# Altium schematic sheet Tray2_Power.SchDoc
size A3
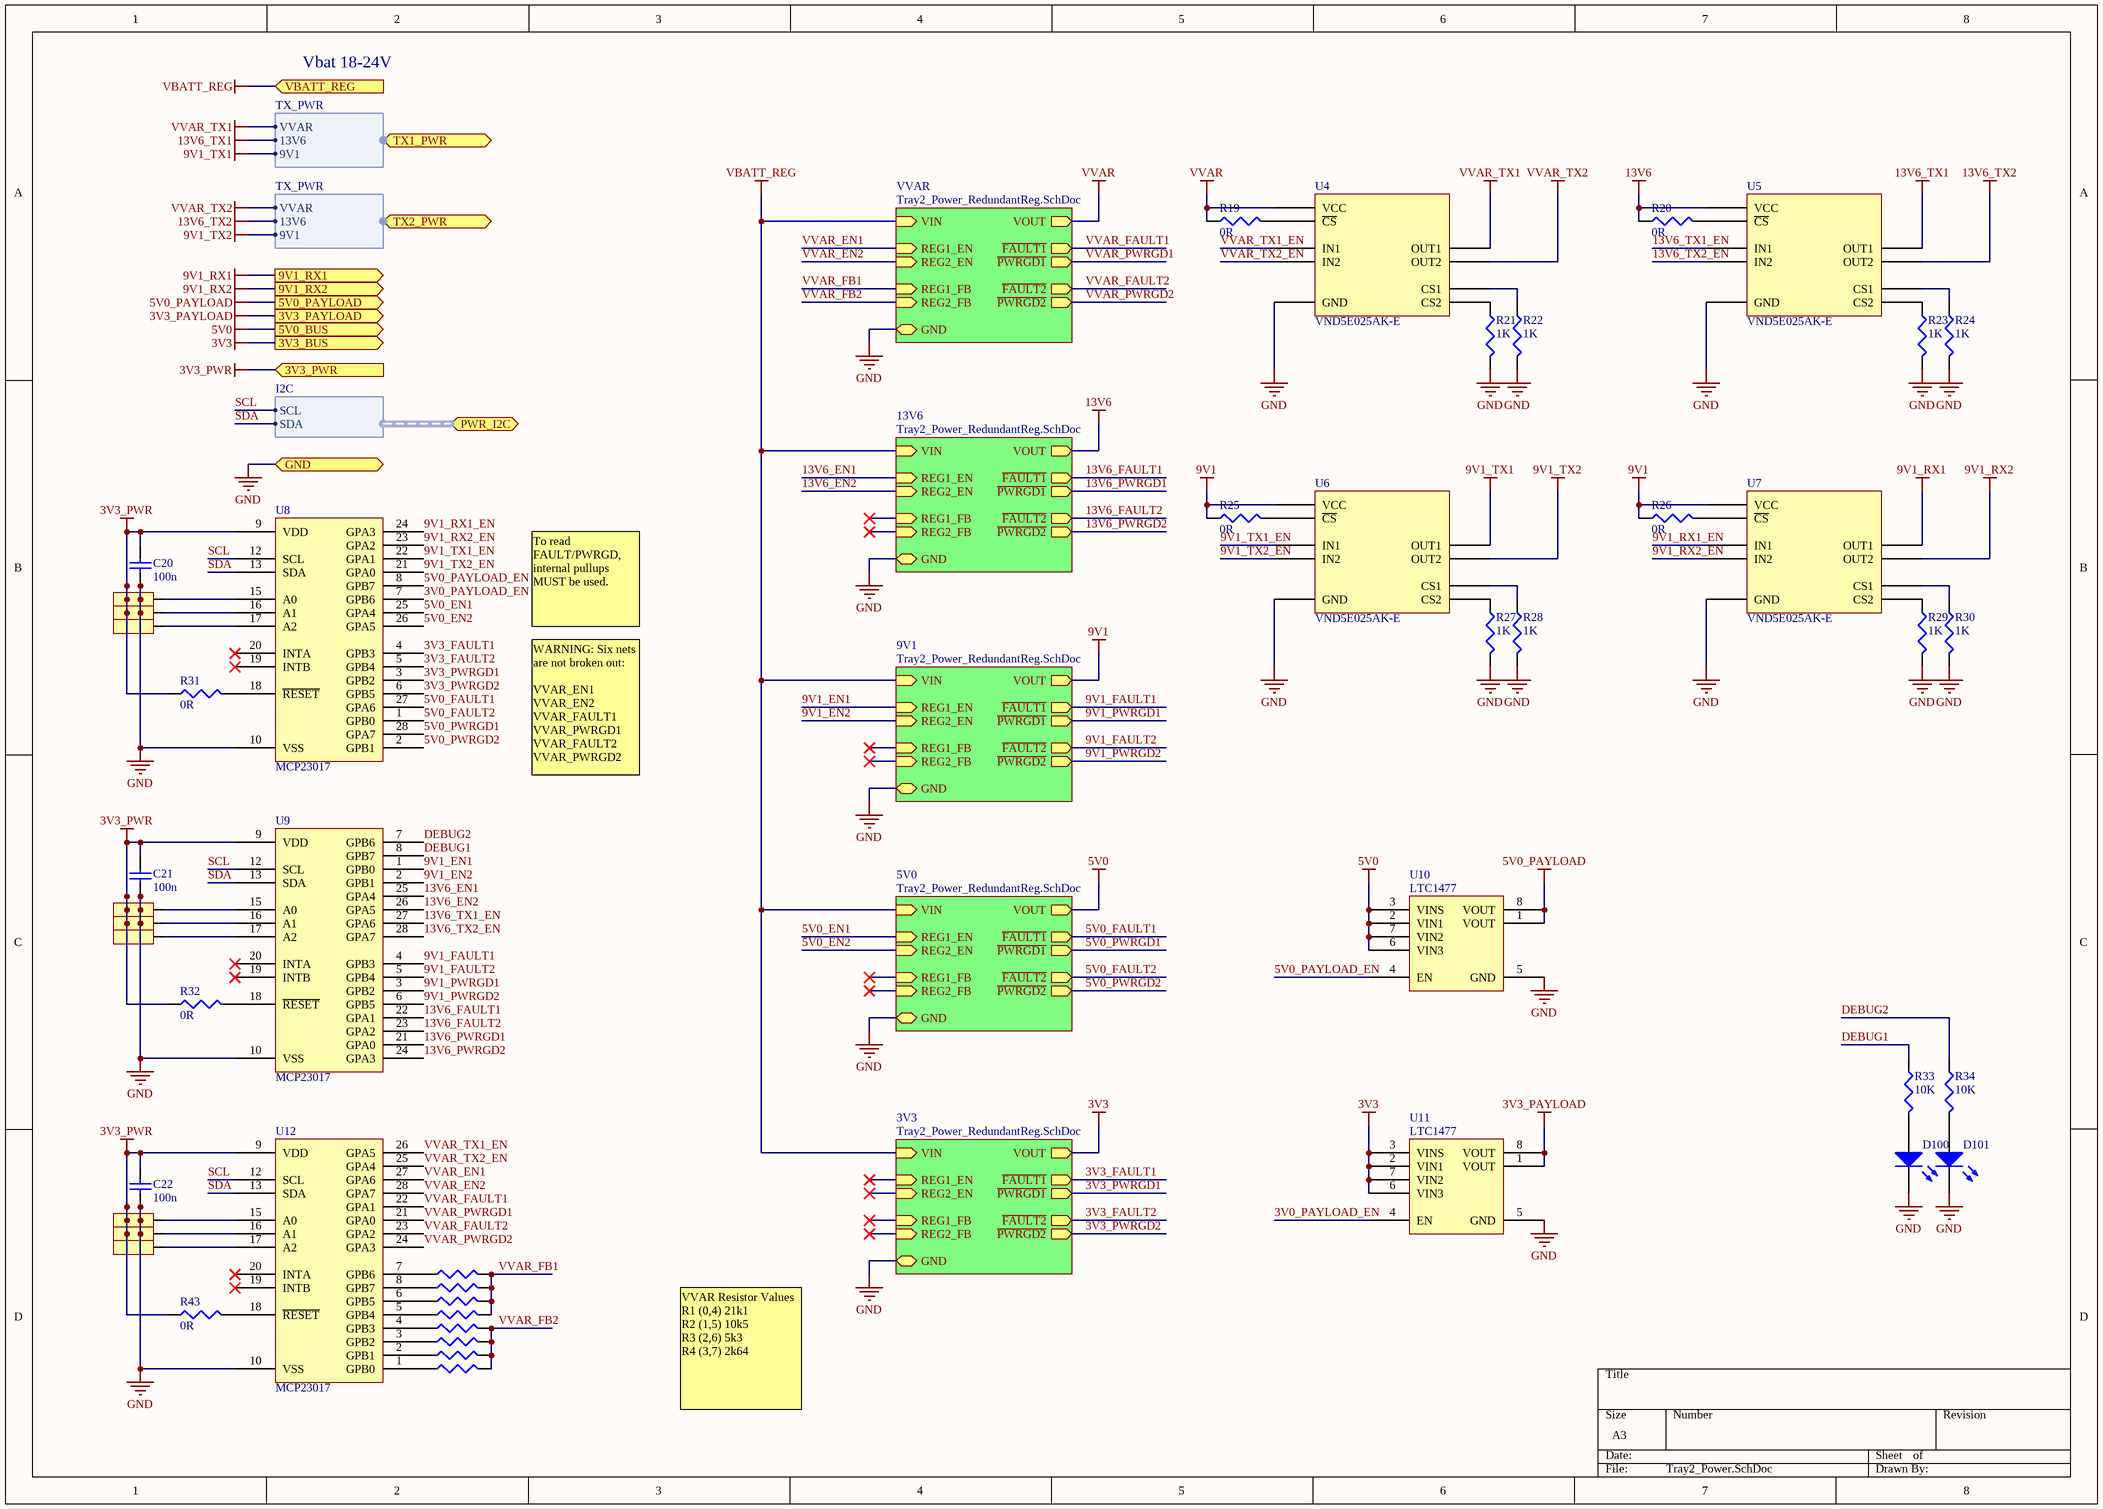
[diagram p0: Tray2_Power.SchDoc]

## Parts
C20  value 100n  [R0805M]
C21  value 100n  [R0805M]
C22  value 100n  [R0805M]
D100  LED0  [R0805M]  (value not drawn)
D101  LED0  [R0805M]  (value not drawn)
J1  3-WAY JUMPER  [J1205M]  (value not drawn)
J2  3-WAY JUMPER  [J1205M]  (value not drawn)
J3  3-WAY JUMPER  [J1205M]  (value not drawn)
J4  3-WAY JUMPER  [J1205M]  (value not drawn)
J5  3-WAY JUMPER  [J1205M]  (value not drawn)
J6  3-WAY JUMPER  [J1205M]  (value not drawn)
J7  3-WAY JUMPER  [J1205M]  (value not drawn)
J8  3-WAY JUMPER  [J1205M]  (value not drawn)
J9  3-WAY JUMPER  [J1205M]  (value not drawn)
R19  value 0R  [R0402M]
R20  value 0R  [R0402M]
R21  value 1K  [R0402M]
R22  value 1K  [R0402M]
R23  value 1K  [R0402M]
R24  value 1K  [R0402M]
R25  value 0R  [R0402M]
R26  value 0R  [R0402M]
R27  value 1K  [R0402M]
R28  value 1K  [R0402M]
R29  value 1K  [R0402M]
R30  value 1K  [R0402M]
R31  value 0R  [R0402M]
R32  value 0R  [R0402M]
R33  value 10K  [R0402M]
R34  value 10K  [R0402M]
R35  VSET_1  [R0805M]  (value not drawn)
R36  VSET_1  [R0805M]  (value not drawn)
R37  VSET_1  [R0805M]  (value not drawn)
R38  VSET_1  [R0805M]  (value not drawn)
R39  VSET_1  [R0805M]  (value not drawn)
R40  VSET_1  [R0805M]  (value not drawn)
R41  VSET_1  [R0805M]  (value not drawn)
R42  VSET_1  [R0805M]  (value not drawn)
R43  value 0R  [R0402M]
U4  VND5E025AK-E  [SSO24]
U5  VND5E025AK-E  [SSO24]
U6  VND5E025AK-E  [SSO24]
U7  VND5E025AK-E  [SSO24]
U8  MCP23017  [SSOP28]
U9  MCP23017  [SSOP28]
U10  LTC1477  [SO8]
U11  LTC1477  [SO8]
U12  MCP23017  [SSOP28]

## Sub-sheets
3V3 = Tray2_Power_RedundantReg.SchDoc: REG1_EN (in), REG2_EN (in), VIN (in), VOUT (out), REG1_FB (in), REG2_FB (in), GND, ~{FAULT1} (out), ~{FAULT2} (out), ~{PWRGD1} (out), ~{PWRGD2} (out)
5V0 = Tray2_Power_RedundantReg.SchDoc: REG1_EN (in), REG2_EN (in), VIN (in), VOUT (out), REG1_FB (in), REG2_FB (in), GND, ~{FAULT1} (out), ~{FAULT2} (out), ~{PWRGD1} (out), ~{PWRGD2} (out)
9V1 = Tray2_Power_RedundantReg.SchDoc: REG1_EN (in), REG2_EN (in), VIN (in), VOUT (out), REG1_FB (in), REG2_FB (in), GND, ~{FAULT1} (out), ~{FAULT2} (out), ~{PWRGD1} (out), ~{PWRGD2} (out)
13V6 = Tray2_Power_RedundantReg.SchDoc: REG1_EN (in), REG2_EN (in), VIN (in), VOUT (out), REG1_FB (in), REG2_FB (in), GND, ~{FAULT1} (out), ~{FAULT2} (out), ~{PWRGD1} (out), ~{PWRGD2} (out)
VVAR = Tray2_Power_RedundantReg.SchDoc: REG1_EN (in), REG2_EN (in), VIN (in), VOUT (out), REG1_FB (in), REG2_FB (in), GND, ~{FAULT1} (out), ~{FAULT2} (out), ~{PWRGD1} (out), ~{PWRGD2} (out)

## Ports
3V3_BUS (out), 3V3_PAYLOAD (out), 3V3_PWR (in), 5V0_BUS (out), 5V0_PAYLOAD (out), 9V1_RX1 (out), 9V1_RX2 (out), GND, PWR_I2C (harness I2C), TX1_PWR (harness TX_PWR), TX2_PWR (harness TX_PWR), VBATT_REG (in)

## Harnesses
I2C: SCL, SDA
TX_PWR: VVAR, 13V6, 9V1

## Nets
3V3: U11.2(VIN1) U11.3(VINS) U11.6(VIN3) U11.7(VIN2) ; port 3V3_BUS, sheet 3V3/VOUT
3V3_PAYLOAD: U11.1(VOUT) U11.8(VOUT) ; port 3V3_PAYLOAD
3V3_PWR: C20.1 C21.1 C22.1 J1.1 J2.1 J3.1 J4.1 J5.1 J6.1 J7.1 J8.1 J9.1 R31.1 R32.1 R43.1 U8.9(VDD) U9.9(VDD) U12.9(VDD) ; port 3V3_PWR
5V0: U10.2(VIN1) U10.3(VINS) U10.6(VIN3) U10.7(VIN2) ; port 5V0_BUS, sheet 5V0/VOUT
5V0_PAYLOAD: U10.1(VOUT) U10.8(VOUT) ; port 5V0_PAYLOAD
9V1: R25.1 R26.1 U6.VCC U7.VCC ; sheet 9V1/VOUT
9V1_RX1: U7.OUT1 ; port 9V1_RX1
9V1_RX2: U7.OUT2 ; port 9V1_RX2
9V1_TX1: U6.OUT1 ; port TX1_PWR.9V1
9V1_TX2: U6.OUT2 ; port TX2_PWR.9V1
13V6: R20.1 U5.VCC ; sheet 13V6/VOUT
13V6_TX1: U5.OUT1 ; port TX1_PWR.13V6
13V6_TX2: U5.OUT2 ; port TX2_PWR.13V6
GND: C20.2 C21.2 C22.2 D100.2(K) D101.2(K) J1.3 J2.3 J3.3 J4.3 J5.3 J6.3 J7.3 J8.3 J9.3 R21.2 R22.2 R23.2 R24.2 R27.2 R28.2 R29.2 R30.2 U4.GND U5.GND U6.GND U7.GND U8.10(VSS) U9.10(VSS) U10.5(GND) U11.5(GND) U12.10(VSS) ; port GND, sheet 13V6/GND, sheet 9V1/GND, sheet 5V0/GND, sheet 3V3/GND, sheet VVAR/GND
VBATT_REG: port VBATT_REG, sheet 13V6/VIN, sheet 9V1/VIN, sheet 5V0/VIN, sheet 3V3/VIN, sheet VVAR/VIN
VVAR: R19.1 U4.VCC ; sheet VVAR/VOUT
VVAR_TX1: U4.OUT1 ; port TX1_PWR.VVAR
VVAR_TX2: U4.OUT2 ; port TX2_PWR.VVAR
3V0_PAYLOAD_EN: U8.7(GPB6) U11.4(EN)
3V3_FAULT1: U8.4(GPB3) ; sheet 3V3/~{FAULT1}
3V3_FAULT2: U8.5(GPB4) ; sheet 3V3/~{FAULT2}
3V3_PWRGD1: U8.3(GPB2) ; sheet 3V3/~{PWRGD1}
3V3_PWRGD2: U8.6(GPB5) ; sheet 3V3/~{PWRGD2}
5V0_EN1: U8.25(GPA4) ; sheet 5V0/REG1_EN
5V0_EN2: U8.26(GPA5) ; sheet 5V0/REG2_EN
5V0_FAULT1: U8.27(GPA6) ; sheet 5V0/~{FAULT1}
5V0_FAULT2: U8.1(GPB0) ; sheet 5V0/~{FAULT2}
5V0_PAYLOAD_EN: U8.8(GPB7) U10.4(EN)
5V0_PWRGD1: U8.28(GPA7) ; sheet 5V0/~{PWRGD1}
5V0_PWRGD2: U8.2(GPB1) ; sheet 5V0/~{PWRGD2}
9V1_EN1: U9.1(GPB0) ; sheet 9V1/REG1_EN
9V1_EN2: U9.2(GPB1) ; sheet 9V1/REG2_EN
9V1_FAULT1: U9.4(GPB3) ; sheet 9V1/~{FAULT1}
9V1_FAULT2: U9.5(GPB4) ; sheet 9V1/~{FAULT2}
9V1_PWRGD1: U9.3(GPB2) ; sheet 9V1/~{PWRGD1}
9V1_PWRGD2: U9.6(GPB5) ; sheet 9V1/~{PWRGD2}
9V1_RX1_EN: U7.IN1 U8.24(GPA3)
9V1_RX2_EN: U7.IN2 U8.23(GPA2)
9V1_TX1_EN: U6.IN1 U8.22(GPA1)
9V1_TX2_EN: U6.IN2 U8.21(GPA0)
13V6_EN1: U9.25(GPA4) ; sheet 13V6/REG1_EN
13V6_EN2: U9.26(GPA5) ; sheet 13V6/REG2_EN
13V6_FAULT1: U9.22(GPA1) ; sheet 13V6/~{FAULT1}
13V6_FAULT2: U9.23(GPA2) ; sheet 13V6/~{FAULT2}
13V6_PWRGD1: U9.21(GPA0) ; sheet 13V6/~{PWRGD1}
13V6_PWRGD2: U9.24(GPA3) ; sheet 13V6/~{PWRGD2}
13V6_TX1_EN: U5.IN1 U9.27(GPA6)
13V6_TX2_EN: U5.IN2 U9.28(GPA7)
DEBUG1: R33.1 U9.8(GPB7)
DEBUG2: R34.1 U9.7(GPB6)
SCL: U8.12(SCL) U9.12(SCL) U12.12(SCL) ; port PWR_I2C.SCL
SDA: U8.13(SDA) U9.13(SDA) U12.13(SDA) ; port PWR_I2C.SDA
VVAR_EN1: U12.27(GPA6) ; sheet VVAR/REG1_EN
VVAR_EN2: U12.28(GPA7) ; sheet VVAR/REG2_EN
VVAR_FAULT1: U12.22(GPA1) ; sheet VVAR/~{FAULT1}
VVAR_FAULT2: U12.23(GPA2) ; sheet VVAR/~{FAULT2}
VVAR_FB1: R35.2 R36.2 R37.2 R38.2 ; sheet VVAR/REG1_FB
VVAR_FB2: R39.2 R40.2 R41.2 R42.2 ; sheet VVAR/REG2_FB
VVAR_PWRGD1: U12.21(GPA0) ; sheet VVAR/~{PWRGD1}
VVAR_PWRGD2: U12.24(GPA3) ; sheet VVAR/~{PWRGD2}
VVAR_TX1_EN: U4.IN1 U12.26(GPA5)
VVAR_TX2_EN: U4.IN2 U12.25(GPA4)
NetD100_1: D100.1(A) R33.2
NetD101_1: D101.1(A) R34.2
NetJ1_2: J1.2 U8.15(A0)
NetJ2_2: J2.2 U8.16(A1)
NetJ3_2: J3.2 U8.17(A2)
NetJ4_2: J4.2 U9.15(A0)
NetJ5_2: J5.2 U9.16(A1)
NetJ6_2: J6.2 U9.17(A2)
NetJ7_2: J7.2 U12.15(A0)
NetJ8_2: J8.2 U12.16(A1)
NetJ9_2: J9.2 U12.17(A2)
NetR19_2: R19.2 U4.CS_DIS(~{CS})
NetR20_2: R20.2 U5.CS_DIS(~{CS})
NetR21_1: R21.1 U4.CS2
NetR22_1: R22.1 U4.CS1
NetR23_1: R23.1 U5.CS2
NetR24_1: R24.1 U5.CS1
NetR25_2: R25.2 U6.CS_DIS(~{CS})
NetR26_2: R26.2 U7.CS_DIS(~{CS})
NetR27_1: R27.1 U6.CS2
NetR28_1: R28.1 U6.CS1
NetR29_1: R29.1 U7.CS2
NetR30_1: R30.1 U7.CS1
NetR31_2: R31.2 U8.18(~{RESET})
NetR32_2: R32.2 U9.18(~{RESET})
NetR35_1: R35.1 U12.7(GPB6)
NetR36_1: R36.1 U12.8(GPB7)
NetR37_1: R37.1 U12.6(GPB5)
NetR38_1: R38.1 U12.5(GPB4)
NetR39_1: R39.1 U12.4(GPB3)
NetR40_1: R40.1 U12.3(GPB2)
NetR41_1: R41.1 U12.2(GPB1)
NetR42_1: R42.1 U12.1(GPB0)
NetR43_2: R43.2 U12.18(~{RESET})

Not connected (* = marked no-connect by the designer): U8 19(INTB)* 20(INTA)*; U9 19(INTB)* 20(INTA)*; U12 19(INTB)* 20(INTA)*

## Notes on the sheet
- Vbat 18-24V
- To read FAULT/PWRGD, internal pullups MUST be used.
- WARNING: Six nets are not broken out:
  VVAR_EN1
  VVAR_EN2
  VVAR_FAULT1
  VVAR_PWRGD1
  VVAR_FAULT2
  VVAR_PWRGD2
- VVAR Resistor Values
  R1 (0,4)	21k1
  R2 (1,5)	10k5
  R3 (2,6)	5k3
  R4 (3,7)	2k64

## Library data of the parts
C20-C22 = Cap: Capacitor; Published: 8-Jun-2000; LatestRevisionDate: 17-Jul-2002; LatestRevisionNote: Re-released for DXP Platform.; PackageReference: RAD-0.3; Publisher: Altium Limited; PackageDescription: Radial Cap, Thru-Hole; 2 Leads; 0.3 in Pin Spacing
D100 D101 = LED0: Typical INFRARED GaAs LED; Published: 8-Jun-2000; LatestRevisionDate: 08-Jul-2005; LatestRevisionNote: Mech Layer 1 removed.; PackageReference: LED-0; Publisher: Altium Limited; PackageDescription: LED; 2 Leads
R19-R43 = Res3: Resistor; Published: 8-Jun-2000; LatestRevisionDate: 29-May-2009; LatestRevisionNote: IPC-7351 Footprint Added.; PackageReference: J1-0603; Publisher: Altium Limited; PackageDescription: Chip Resistor
U4-U7 = VND5E025AK-E: Double channel high-side driver with analog current sense
U8 U9 U12 = MCP23017: 16-Bit I/O Expander with Serial Interface
U10 U11 = LTC1477: Single Protected High Side Switches